# Altium schematic sheet MCU.SchDoc
size A4
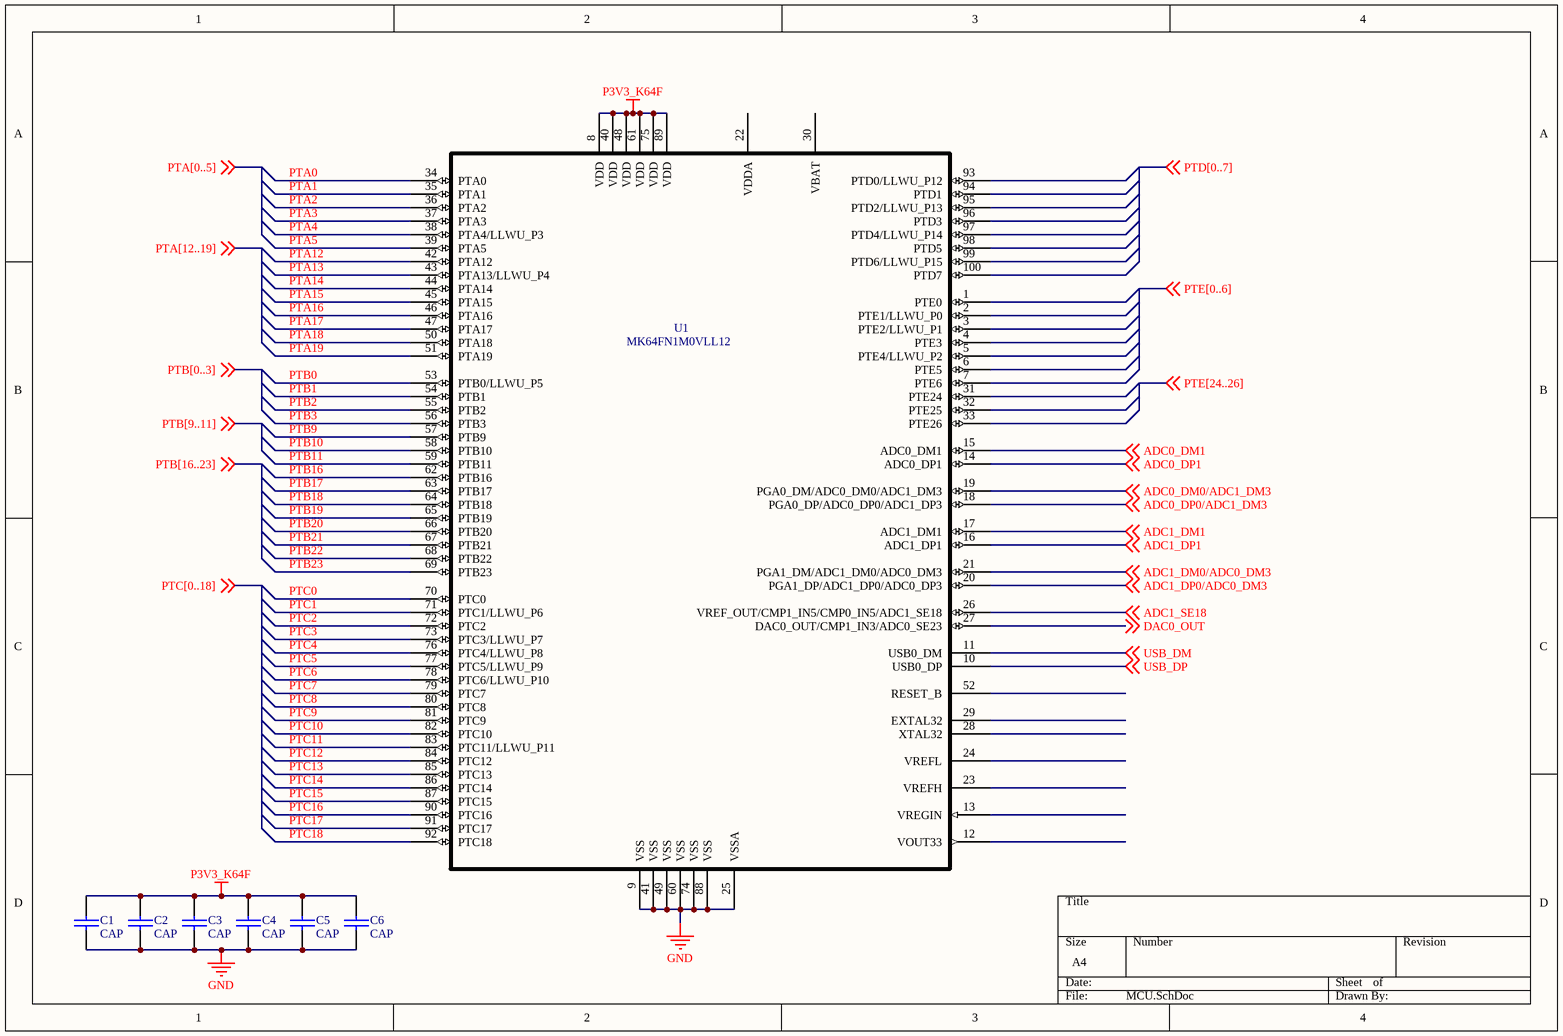
[diagram p0: MCU.SchDoc]

## Parts
C1  CAP  [0805]
C2  CAP  [0805]
C3  CAP  [0805]
C4  CAP  [0805]
C5  CAP  [0805]
C6  CAP  [0805]
U1  MK64FN1M0VLL12  [LQFP-100_14X14X1]

## Nets
GND: C1.2 C2.2 C3.2 C4.2 C5.2 C6.2 U1.9(VSS) U1.25(VSSA) U1.41(VSS) U1.49(VSS) U1.60(VSS) U1.74(VSS) U1.88(VSS)
P3V3_K64F: C1.1 C2.1 C3.1 C4.1 C5.1 C6.1 U1.8(VDD) U1.40(VDD) U1.48(VDD) U1.61(VDD) U1.75(VDD) U1.89(VDD)
ADC0_DM0/ADC1_DM3: U1.19(PGA0_DM/ADC0_DM0/ADC1_DM3) ; off-sheet ADC0_DM0/ADC1_DM3
ADC0_DM1: U1.15(ADC0_DM1) ; off-sheet ADC0_DM1
ADC0_DP0/ADC1_DM3: U1.18(PGA0_DP/ADC0_DP0/ADC1_DP3) ; off-sheet ADC0_DP0/ADC1_DM3
ADC0_DP1: U1.14(ADC0_DP1) ; off-sheet ADC0_DP1
ADC1_DM0/ADC0_DM3: U1.21(PGA1_DM/ADC1_DM0/ADC0_DM3) ; off-sheet ADC1_DM0/ADC0_DM3
ADC1_DM1: U1.17(ADC1_DM1) ; off-sheet ADC1_DM1
ADC1_DP0/ADC0_DM3: U1.20(PGA1_DP/ADC1_DP0/ADC0_DP3) ; off-sheet ADC1_DP0/ADC0_DM3
ADC1_DP1: U1.16(ADC1_DP1) ; off-sheet ADC1_DP1
ADC1_SE18: U1.26(VREF_OUT/CMP1_IN5/CMP0_IN5/ADC1_SE18) ; off-sheet ADC1_SE18
DAC0_OUT: U1.27(DAC0_OUT/CMP1_IN3/ADC0_SE23) ; off-sheet DAC0_OUT
PTA0: U1.34(PTA0)
PTA1: U1.35(PTA1)
PTA2: U1.36(PTA2)
PTA3: U1.37(PTA3)
PTA4: U1.38(PTA4/LLWU_P3)
PTA5: U1.39(PTA5)
PTA12: U1.42(PTA12)
PTA13: U1.43(PTA13/LLWU_P4)
PTA14: U1.44(PTA14)
PTA15: U1.45(PTA15)
PTA16: U1.46(PTA16)
PTA17: U1.47(PTA17)
PTA18: U1.50(PTA18)
PTA19: U1.51(PTA19)
PTB0: U1.53(PTB0/LLWU_P5)
PTB1: U1.54(PTB1)
PTB2: U1.55(PTB2)
PTB3: U1.56(PTB3)
PTB9: U1.57(PTB9)
PTB10: U1.58(PTB10)
PTB11: U1.59(PTB11)
PTB16: U1.62(PTB16)
PTB17: U1.63(PTB17)
PTB18: U1.64(PTB18)
PTB19: U1.65(PTB19)
PTB20: U1.66(PTB20)
PTB21: U1.67(PTB21)
PTB22: U1.68(PTB22)
PTB23: U1.69(PTB23)
PTC0: U1.70(PTC0)
PTC1: U1.71(PTC1/LLWU_P6)
PTC2: U1.72(PTC2)
PTC3: U1.73(PTC3/LLWU_P7)
PTC4: U1.76(PTC4/LLWU_P8)
PTC5: U1.77(PTC5/LLWU_P9)
PTC6: U1.78(PTC6/LLWU_P10)
PTC7: U1.79(PTC7)
PTC8: U1.80(PTC8)
PTC9: U1.81(PTC9)
PTC10: U1.82(PTC10)
PTC11: U1.83(PTC11/LLWU_P11)
PTC12: U1.84(PTC12)
PTC13: U1.85(PTC13)
PTC14: U1.86(PTC14)
PTC15: U1.87(PTC15)
PTC16: U1.90(PTC16)
PTC17: U1.91(PTC17)
PTC18: U1.92(PTC18)
USB_DM: U1.11(USB0_DM) ; off-sheet USB_DM
USB_DP: U1.10(USB0_DP) ; off-sheet USB_DP

Not connected (* = marked no-connect by the designer): U1 1(PTE0) 2(PTE1/LLWU_P0) 3(PTE2/LLWU_P1) 4(PTE3) 5(PTE4/LLWU_P2) 6(PTE5) 7(PTE6) 12(VOUT33) 13(VREGIN) 22(VDDA) 23(VREFH) 24(VREFL) 28(XTAL32) 29(EXTAL32) 30(VBAT) 31(PTE24) 32(PTE25) 33(PTE26) 52(RESET_B) 93(PTD0/LLWU_P12) 94(PTD1) 95(PTD2/LLWU_P13) 96(PTD3) 97(PTD4/LLWU_P14) 98(PTD5) 99(PTD6/LLWU_P15) 100(PTD7)

## Library data of the parts
U1 = MK64FN1M0VLL12: Imported; Vendor: FREESCALE; CPU: ARM Cortex-M4F; Max_Frequency: 120; Flash_KB: 1024; SRAM_KB: 256; Pin_Count: 100; Manufacturer_Part_Number: mk64fn1m0vll12; Package: LQFP; RefDes: RefDes; Type: Type; Value: Value